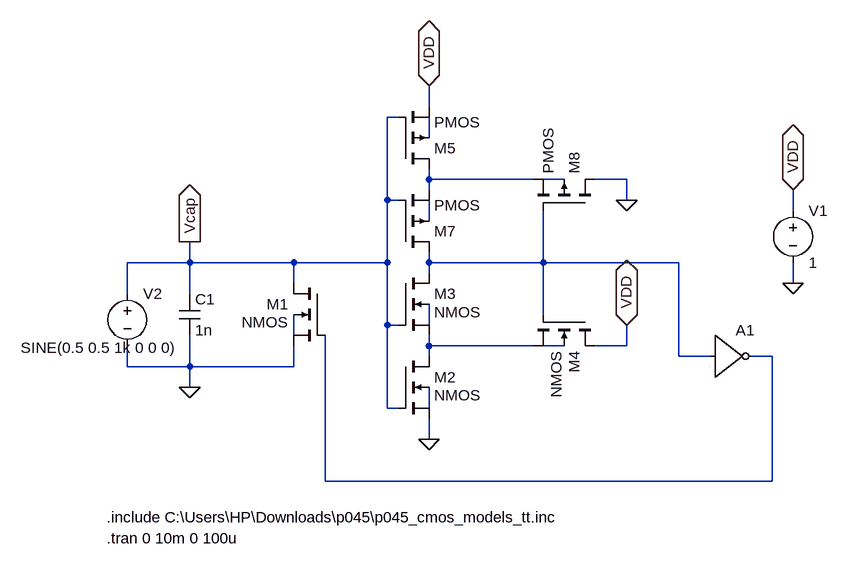
[diagram p0: schematic ifc.asc]
ifc.asc, the LTspice schematic file:
Version 4
SHEET 1 1876 696
WIRE 416 -64 416 -96
WIRE 368 -48 352 -48
WIRE 416 -16 416 -48
WIRE 416 48 416 32
WIRE 576 48 416 48
WIRE 624 48 592 48
WIRE 720 48 672 48
WIRE 416 64 416 48
WIRE 352 80 352 -48
WIRE 368 80 352 80
WIRE 720 80 720 48
WIRE 976 96 976 64
WIRE 416 112 416 80
WIRE 48 176 48 144
WIRE 48 176 -48 176
WIRE 208 176 48 176
WIRE 352 176 352 80
WIRE 352 176 208 176
WIRE 416 176 416 160
WIRE 592 176 592 96
WIRE 592 176 416 176
WIRE 800 176 592 176
WIRE 416 192 416 176
WIRE 208 208 208 176
WIRE 976 208 976 176
WIRE -48 224 -48 176
WIRE 48 224 48 176
WIRE 592 256 592 176
WIRE 352 272 352 176
WIRE 368 272 352 272
WIRE 416 272 416 240
WIRE 208 288 208 256
WIRE 416 304 416 288
WIRE 576 304 416 304
WIRE 624 304 592 304
WIRE 720 304 720 272
WIRE 720 304 672 304
WIRE 416 320 416 304
WIRE 800 320 800 176
WIRE 848 320 800 320
WIRE 944 320 912 320
WIRE -48 336 -48 304
WIRE 48 336 48 288
WIRE 48 336 -48 336
WIRE 208 336 208 304
WIRE 208 336 48 336
WIRE 48 368 48 336
WIRE 352 400 352 272
WIRE 368 400 352 400
WIRE 416 400 416 368
WIRE 416 448 416 416
WIRE 256 512 256 288
WIRE 944 512 944 320
WIRE 944 512 256 512
FLAG 48 368 0
FLAG 48 144 Vcap
IOPIN 48 144 Out
FLAG 720 80 0
FLAG 720 272 VDD
IOPIN 720 272 BiDir
FLAG 416 448 0
FLAG 416 -96 VDD
IOPIN 416 -96 BiDir
FLAG 976 208 0
FLAG 976 64 VDD
IOPIN 976 64 BiDir
SYMBOL cap 32 224 R0
SYMATTR InstName C1
SYMATTR Value 1n
SYMATTR SpiceLine V=25 Irms=0 Rser=0 Lser=380p Rpar=0
SYMBOL Digital\\inv 848 256 R0
SYMATTR InstName A1
SYMBOL voltage 976 80 R0
WINDOW 123 0 0 Left 0
WINDOW 39 0 0 Left 0
SYMATTR InstName V1
SYMATTR Value 1
SYMBOL voltage -48 208 R0
WINDOW 123 0 0 Left 0
WINDOW 39 101 3 Left 2
WINDOW 3 -164 99 Left 2
SYMATTR Value SINE(0.5 0.5 1k 0 0 0)
SYMATTR InstName V2
SYMBOL nmos4 368 320 R0
WINDOW 3 56 60 Left 2
SYMATTR InstName M2
SYMATTR Value2 l=0.05u w=0.25u
SYMBOL nmos4 368 192 R0
WINDOW 3 56 60 Left 2
SYMATTR InstName M3
SYMATTR Value2 l=0.05u w=0.25u
SYMBOL nmos4 256 208 M0
WINDOW 3 56 60 Left 2
SYMATTR InstName M1
SYMATTR Value2 l=0.05u w=0.5u
SYMBOL nmos4 672 256 R90
WINDOW 3 56 60 Left 2
SYMATTR InstName M4
SYMATTR Value2 l=0.05u w=0.25u
SYMBOL pmos4 368 32 M180
SYMATTR InstName M5
SYMATTR Value2 l=0.05u w=2u
SYMBOL pmos4 368 160 M180
SYMATTR InstName M7
SYMATTR Value2 l=0.05u w=2u
SYMBOL pmos4 672 96 M270
SYMATTR InstName M8
SYMATTR Value2 l=0.05u w=2u
TEXT -80 600 Left 2 !.tran 0 10m 0 100u
TEXT -80 568 Left 2 !.include C:\\Users\\HP\\Downloads\\p045\\p045_cmos_models_tt.inc

The netlist it stands for:
* ifc.asc
C1 Vcap 0 1n V=25 Irms=0 Rser=0 Lser=380p Rpar=0
A1 N005 0 0 0 0 N010 0 0 BUF
V1 VDD 0 1
V2 Vcap 0 SINE(0.5 0.5 1k 0 0 0)
M2 N008 Vcap 0 N011 NMOS l=0.05u w=0.25u
M3 N005 Vcap N008 N006 NMOS l=0.05u w=0.25u
M1 Vcap N010 0 N007 NMOS l=0.05u w=0.5u
M4 VDD N005 N008 N009 NMOS l=0.05u w=0.25u
M5 N002 Vcap VDD N001 PMOS l=0.05u w=2u
M7 N005 Vcap N002 N004 PMOS l=0.05u w=2u
M8 0 N005 N002 N003 PMOS l=0.05u w=2u
.model NMOS NMOS
.model PMOS PMOS
.lib standard.mos
.tran 0 10m 0 100u
.include C:\Users\HP\Downloads\p045\p045_cmos_models_tt.inc
.backanno
.end